# Altium schematic sheet Flash.SchDoc
size A4; SheetNumber: 3; SheetTotal: 5
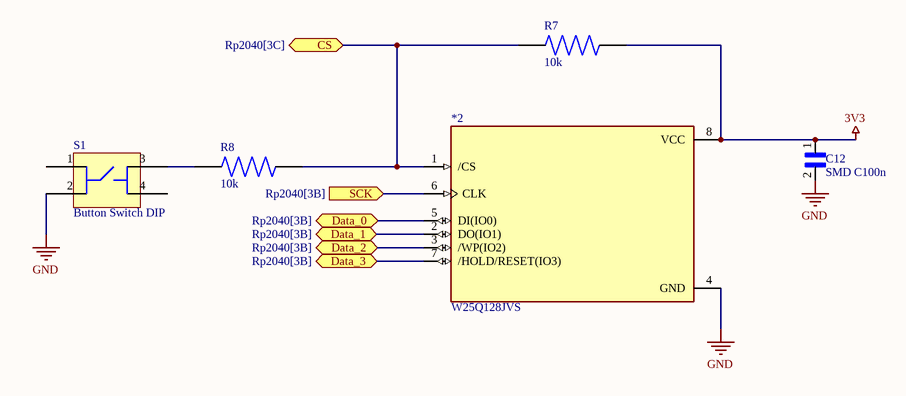
[diagram p0: Flash.SchDoc]

## Parts
*2  W25Q128JVS  [W25Q128JVS-Footprint-1]
C12  SMD C100n  [SMD Capacetor-Footprint-1]
R7  10k  [SMD Resistor-Footprint-1]
R8  10k  [SMD Resistor-Footprint-1]
S1  Button Switch DIP  [Button Switch DIP -Footprint-1]

## Ports
CS (bidir, see Rp2040[3C]), Data_0 (bidir, see Rp2040[3B]), Data_1 (bidir, see Rp2040[3B]), Data_2 (bidir, see Rp2040[3B]), Data_3 (bidir, see Rp2040[3B]), SCK (in, see Rp2040[3B])

## Nets
3V3: *2.8(VCC) C12.1 R7.2
GND: *2.4(GND) C12.2 S1.2
CS: *2.1(/CS) R7.1 R8.2 ; port CS
Data_0: *2.5(DI(IO0)) ; port Data_0
Data_1: *2.2(DO(IO1)) ; port Data_1
Data_2: *2.3(/WP(IO2)) ; port Data_2
Data_3: *2.7(/HOLD/RESET(IO3)) ; port Data_3
SCK: *2.6(CLK) ; port SCK
NetR8_1: R8.1 S1.3

Not connected (* = marked no-connect by the designer): S1 1 4

## Library data of the parts
*2 = CMP-00021-1: Flash Memory
C12 = CMP-00017-4: Generic SMD Capacetor
R7 R8 = CMP-00019-2: Generic SMD Resistor
S1 = CMP-00005-1: 4 Pin